# Altium schematic sheet M6_base_simple.SchDoc
size 431 x 279 mm; SheetNumber: 1; SheetTotal: 1
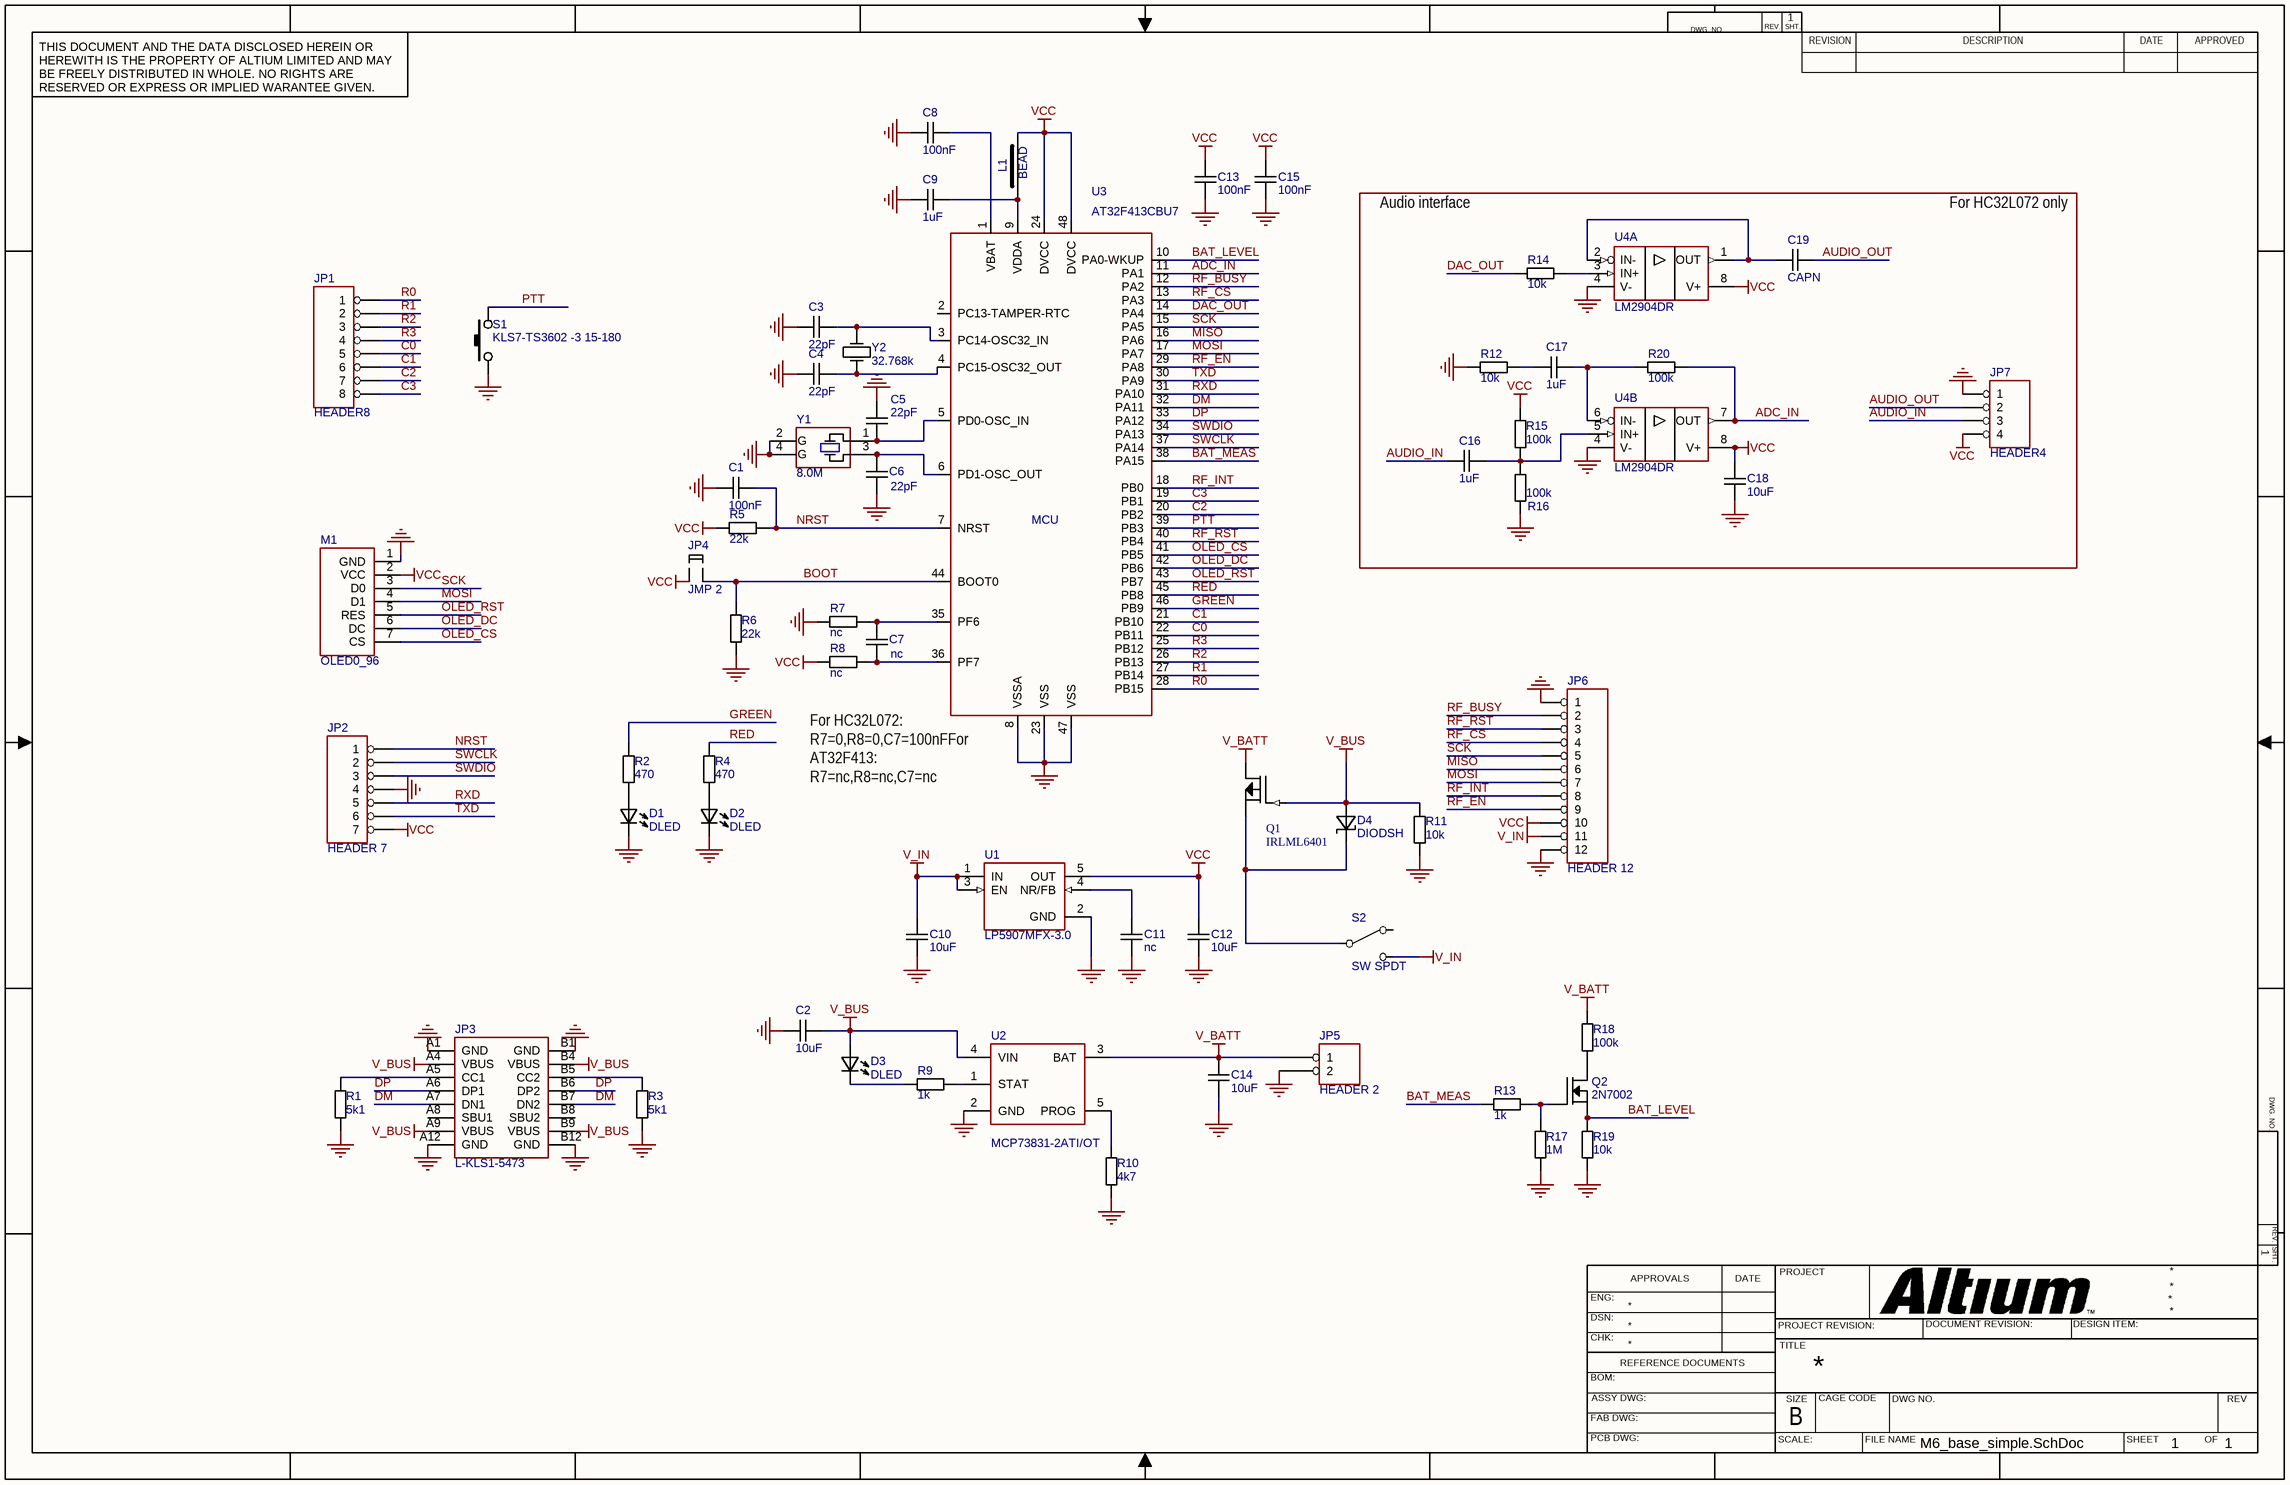
[diagram p0: M6_base_simple.SchDoc]

## Parts
C1  100nF  [C-0603]
C2  10uF  [C-0805]
C3  22pF  [C-0603]
C4  22pF  [C-0603]
C5  22pF  [C-0603]
C6  22pF  [C-0603]
C7  nc  [C-0603]
C8  100nF  [C-0603]
C9  1uF  [C-0603]
C10  10uF  [C-0805]
C11  nc  [C-0603]
C12  10uF  [C-0805]
C13  100nF  [C-0603]
C14  10uF  [C-0805]
C15  100nF  [C-0603]
C16  1uF  [C-0603]
C17  1uF  [C-0603]
C18  10uF  [C-0805]
C19  CAPN  [C-0805]
D1  DLED  [LED_3mm_RED]
D2  DLED  [LED_3mm_RED]
D3  DLED  [LED_3mm_RED]
D4  DIODSH  [D-SMA]
JP1  HEADER8  [PLS1-8R_1]
JP2  HEADER 7  [PLS1-7]
JP3  L-KLS1-5473  [L-KLS1-5473]
JP4  JMP 2  [PLS1-2]
JP5  HEADER 2  [PLS1-2]
JP6  HEADER 12  [PLS1-12R_1]
JP7  HEADER4  [PLS1-4R]
L1  BEAD  [L-0603]
M1  OLED0_96  [OLED096]
Q1  IRLML6401  [SOT-23]
Q2  2N7002  [SOT-23]
R1  5k1  [R-0603]
R2  470  [R-0603]
R3  5k1  [R-0603]
R4  470  [R-0603]
R5  22k  [R-0603]
R6  22k  [R-0603]
R7  nc  [R-0603]
R8  nc  [R-0603]
R9  1k  [R-0603]
R10  4k7  [R-0603]
R11  10k  [R-0603]
R12  10k  [R-0603]
R13  1k  [R-0603]
R14  10k  [R-0603]
R15  100k  [R-0603]
R16  100k  [R-0603]
R17  1M  [R-0603]
R18  100k  [R-0603]
R19  10k  [R-0603]
R20  100k  [R-0603]
S1  KLS7-TS3602 -3 15-180  [KLS7-TS3602]
S2  SW SPDT  [SK-12D07VG5]
U1  LP5907MFX-3.0  [SOT-23-5]
U2  MCP73831-2ATI/OT  [SOT-23-5]
U3  AT32F413CBU7  [LQFP-48]
U4  LM2904DR  [SO-8]  (parts A,B of 2)
Y1  8.0M  [ZQ_SJK-7U]
Y2  32.768k  [KX-327]

## Nets
GND: C1.1 C2.1 C3.1 C4.1 C5.1 C6.2 C8.2 C9.1 C10.2 C11.2 C12.2 C13.1 C14.1 C15.1 C18.1 D1.2 D2.2 JP2.4 JP3.A1(GND) JP3.A12(GND) JP3.B1(GND) JP3.B12(GND) JP5.2 JP6.1 JP6.12 JP7.1 M1.1(GND) R1.1 R3.1 R6.1 R7.1 R10.1 R11.1 R12.1 R16.2 R17.1 R19.1 S1.1 U1.2(GND) U2.2(GND) U3.8(VSSA) U3.23(VSS) U3.47(VSS) U4.4(V-) Y1.2(GND) Y1.4(GND)
V_BATT: C14.2 JP5.1 Q1.3(DRAIN) R18.2 U2.3(BAT)
V_BUS: C2.2 D3.1 D4.1 JP3.A4(VBUS) JP3.A9(VBUS) JP3.B4(VBUS) JP3.B9(VBUS) Q1.1(GATE) R11.2 U2.4(VIN)
V_IN: C10.1 JP6.11 S2.3(NO) U1.1(IN) U1.3(EN)
VCC: C12.1 C13.2 C15.2 C18.2 JP2.7 JP4.1 JP6.10 JP7.4 L1.2 M1.2(VCC) R5.1 R8.1 R15.2 U1.5(OUT) U3.24(DVCC) U3.48(DVCC) U4.8(V+)
ADC_IN: R20.1 U3.11(PA1) U4.7(OUT)
AUDIO_IN: C16.1 JP7.3
AUDIO_OUT: C19.2 JP7.2
BAT_LEVEL: Q2.2(SOURCE) R19.2 U3.10(PA0-WKUP)
BAT_MEAS: R13.2 U3.38(PA15)
BOOT: JP4.2 R6.2 U3.44(BOOT0)
C0: JP1.5 U3.22(PB11)
C1: JP1.6 U3.21(PB10)
C2: JP1.7 U3.20(PB2)
C3: JP1.8 U3.19(PB1)
DAC_OUT: R14.1 U3.14(PA4)
DM: JP3.A7(DN1) JP3.B7(DN2) U3.32(PA11)
DP: JP3.A6(DP1) JP3.B6(DP2) U3.33(PA12)
GREEN: R2.2 U3.46(PB9)
MISO: JP6.6 U3.16(PA6)
MOSI: JP6.7 M1.4(D1) U3.17(PA7)
NRST: C1.2 JP2.1 R5.2 U3.7(NRST)
OLED_CS: M1.7(CS) U3.41(PB5)
OLED_DC: M1.6(DC) U3.42(PB6)
OLED_RST: M1.5(RES) U3.43(PB7)
PTT: S1.2 U3.39(PB3)
R0: JP1.1 U3.28(PB15)
R1: JP1.2 U3.27(PB14)
R2: JP1.3 U3.26(PB13)
R3: JP1.4 U3.25(PB12)
RED: R4.2 U3.45(PB8)
RF_BUSY: JP6.2 U3.12(PA2)
RF_CS: JP6.4 U3.13(PA3)
RF_EN: JP6.9 U3.29(PA8)
RF_INT: JP6.8 U3.18(PB0)
RF_RST: JP6.3 U3.40(PB4)
RXD: JP2.5 U3.31(PA10)
SCK: JP6.5 M1.3(D0) U3.15(PA5)
SWCLK: JP2.2 U3.37(PA14)
SWDIO: JP2.3 U3.34(PA13)
TXD: JP2.6 U3.30(PA9)
NetC3_2: C3.2 U3.3(PC14-OSC32_IN) Y2.2
NetC4_2: C4.2 U3.4(PC15-OSC32_OUT) Y2.1
NetC5_2: C5.2 U3.5(PD0-OSC_IN) Y1.1
NetC6_1: C6.1 U3.6(PD1-OSC_OUT) Y1.3
NetC7_1: C7.1 R7.2 U3.35(PF6)
NetC7_2: C7.2 R8.2 U3.36(PF7)
NetC8_1: C8.1 U3.1(VBAT)
NetC9_2: C9.2 L1.1 U3.9(VDDA)
NetC11_1: C11.1 U1.4(NR/FB)
NetC16_2: C16.2 R15.1 R16.1 U4.5(IN+)
NetC17_1: C17.1 R12.2
NetC17_2: C17.2 R20.2 U4.6(IN-)
NetC19_1: C19.1 U4.1(OUT) U4.2(IN-)
NetD1_1: D1.1 R2.1
NetD2_1: D2.1 R4.1
NetD3_2: D3.2 R9.2
NetD4_2: D4.2 Q1.2(SOURCE) S2.2(COMMON)
NetJP3_A5: JP3.A5(CC1) R1.2
NetJP3_B5: JP3.B5(CC2) R3.2
NetQ2_1: Q2.1(GATE) R13.1 R17.2
NetQ2_3: Q2.3(DRAIN) R18.1
NetR9_1: R9.1 U2.1(STAT)
NetR10_2: R10.2 U2.5(PROG)
NetR14_2: R14.2 U4.3(IN+)

Not connected (* = marked no-connect by the designer): JP3 17(VSS) A8(SBU1) B8(SBU2); S2 1(NC); U3 2(PC13-TAMPER-RTC)

## Notes on the sheet
- Audio interface
- For HC32L072 only
- (near U3) For HC32L072:
  R7=0,R8=0,C7=100nFFor AT32F413: R7=nc,R8=nc,C7=nc
- Type @ to refer to a designator or a net
- DWG. NO.
- REV.
- SHT.
- THIS DOCUMENT AND THE DATA DISCLOSED HEREIN OR HEREWITH IS THE PROPERTY OF ALTIUM LIMITED AND MAY BE FREELY DISTRIBUTED IN WHOLE. NO RIGHTS ARE RESERVED OR EXPRESS OR IMPLIED WARANTEE GIVEN.
- REVISION
- DESCRIPTION
- DATE
- APPROVED
- ENG:
- APPROVALS
- PROJECT
- DSN:
- CHK:
- REFERENCE DOCUMENTS
- PROJECT REVISION:
- TITLE
- DOCUMENT REVISION:
- DESIGN ITEM:
- BOM:
- FAB DWG:
- PCB DWG:
- ASSY DWG:
- SCALE:
- SIZE
- B
- CAGE CODE
- FILE NAME
- DWG NO.
- SHEET
- OF
- REV
- (in symbol AT32F413CBU7) MCU
- (in symbol TSX-3225) G

## Library data of the parts
C1-C19 = CAPN: Voltage: 50V; Точність/група: NP0; Вид: Конденсатор
D1-D3 = DLED: Вид: Світлодіод
D4 = DIODSH: Вид: Діод
JP1 = HEADER8: Вид: Роз'єм; *: *
JP2 = HEADER 7: Вид: Роз'єм; *: *
JP3 = L-KLS1-5473: Mounting  Method: SMD; Value: *
JP4 = JMP 2: Вид: Роз'єм
JP5 = HEADER 2: Вид: Роз'єм; *: *
JP6 = HEADER 12: Вид: Роз'єм; *: *
JP7 = HEADER4: Вид: Роз'єм; *: *
L1 = BEAD: Вид: Ferrite bead
Q1 = MOSF-P: Вид: Транзистор
Q2 = MOSF-N: Вид: Транзистор
R1-R20 = RES: Точність/група: 5%; Вид: Резистор
S1 = SW-1: Вид: Кнопка; Робоча напруга: *
S2 = SW SPDT: Вид: Перемикач; Виробник: *; *: *
U1 = LP5907: 250mA Low-Dropout Regulator; Вид: Мікросхема
U2 = MCP73831-2ATI/OT: Library Part: IC`s.SchLib; Manufacturer: Texas Instruments; Man#Part Num#: TPS61023DRLT; Value: {Value}; Mounting  Method: SMD; IC Type: PMIC; Part Number: MCP73831-2ATI/OT; Footprint Part: IC-package.PcbLib; Package: SOT-563; Part Type: IC; Component Type: SMD; Temperature Range: -40°C ~ 125°C (TJ); URL: https://www.ti.com/general/docs/suppproductinfo.tsp?distId=10&gotoUrl=https%3A%2F%2Fwww.ti.com%2Flit%2Fgpn%2Ftps61023; Suplier 1: https://www.digikey.com.au/en/products/detail/texas-instruments/TPS61023DRLT/11310622?s=N4IgTCBcDaICoAUDKA2AjABjAZgCICUAZOEAXQF8g
U3 = AT32F413CBU7: Вид: Мікросхема
U4 = LM2904: Dual Operational Amplifiers, SOIC-8; Вид: Мікросхема
Y1 = TSX-3225: Crystal, 24 MHz, 9 pF, SMD; Вид: Трансформатор
Y2 = Y: Точність/група: 20ppm; Вид: Кварц